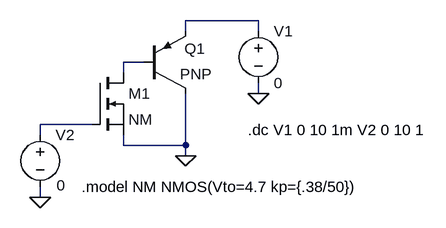
[diagram p0: schematic builtin_05_IGBTeq.asc]
builtin_05_IGBTeq.asc, the LTspice schematic file:
Version 4
SHEET 1 1236 944
WIRE 928 400 816 400
WIRE 816 416 816 400
WIRE 928 416 928 400
WIRE 752 464 720 464
WIRE 720 480 720 464
WIRE 928 512 928 496
WIRE 672 560 592 560
WIRE 592 576 592 560
WIRE 720 592 720 576
WIRE 816 592 816 512
WIRE 816 592 720 592
WIRE 816 608 816 592
WIRE 592 672 592 656
FLAG 816 608 0
FLAG 928 512 0
FLAG 592 672 0
SYMBOL nmos 672 480 R0
SYMATTR InstName M1
SYMATTR Value NM
SYMBOL pnp 752 512 M180
WINDOW 0 62 69 Left 0
WINDOW 3 55 30 Left 0
SYMATTR InstName Q1
SYMBOL voltage 928 400 R0
SYMATTR InstName V1
SYMATTR Value 0
SYMBOL voltage 592 560 R0
WINDOW 3 25 94 Left 0
SYMATTR InstName V2
SYMATTR Value 0
TEXT 656 656 Left 0 !.model NM NMOS(Vto=4.7 kp={.38/50})
TEXT 912 568 Left 0 !.dc V1 0 10 1m V2 0 10 1

The netlist it stands for:
* builtin_05_IGBTeq.asc
M1 N002 N003 0 0 NM
Q1 0 N002 N001 0 PNP
V1 N001 0 0
V2 N003 0 0
.model NPN NPN
.model PNP PNP
.lib standard.bjt
.model NMOS NMOS
.model PMOS PMOS
.lib standard.mos
.model NM NMOS(Vto=4.7 kp={.38/50})
.dc V1 0 10 1m V2 0 10 1
.backanno
.end